# Altium schematic sheet PSU_VCC5V_Buck.SchDoc
size A3; SheetNumber: 3; SheetTotal: 32
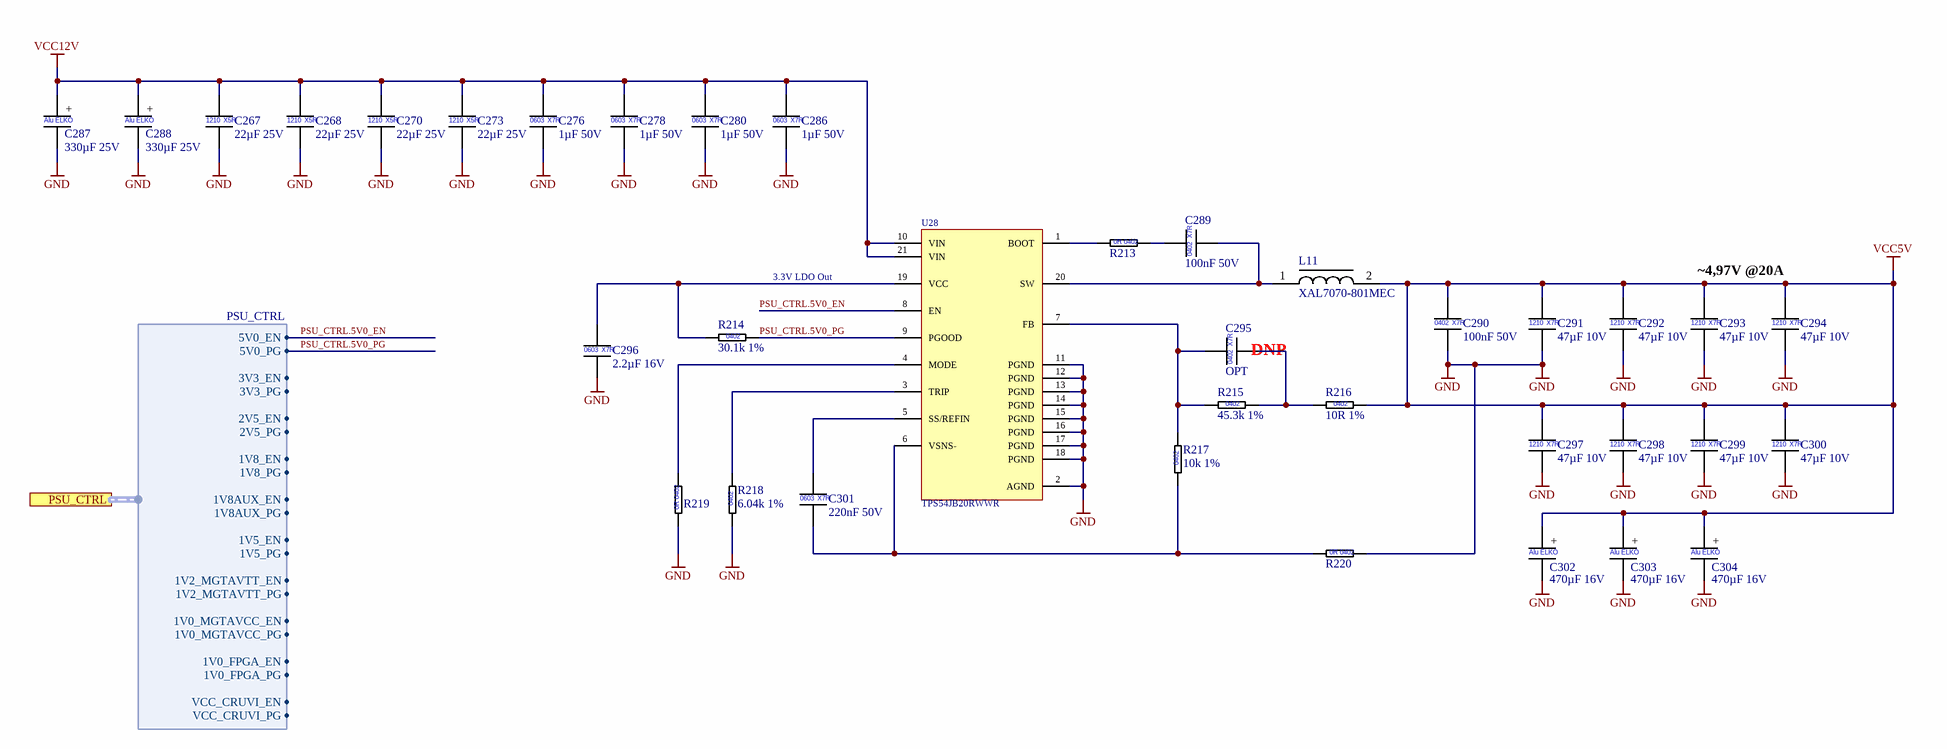
[diagram p0: PSU_VCC5V_Buck.SchDoc]

## Parts
C267  22µF 25V  [CAP_1210]
C268  22µF 25V  [CAP_1210]
C270  22µF 25V  [CAP_1210]
C273  22µF 25V  [CAP_1210]
C276  1µF 50V  [CAP_0603]
C278  1µF 50V  [CAP_0603]
C280  1µF 50V  [CAP_0603]
C286  1µF 50V  [CAP_0603]
C287  330µF 25V  [WCAP-PTG5_D10H12.5]
C288  330µF 25V  [WCAP-PTG5_D10H12.5]
C289  100nF 50V  [CAP_0402]
C290  100nF 50V  [CAP_0402]
C291  47µF 10V  [CAP_1210]
C292  47µF 10V  [CAP_1210]
C293  47µF 10V  [CAP_1210]
C294  47µF 10V  [CAP_1210]
C295  OPT  [CAP_0402]  (no BOM)
C296  2.2µF 16V  [CAP_0603]
C297  47µF 10V  [CAP_1210]
C298  47µF 10V  [CAP_1210]
C299  47µF 10V  [CAP_1210]
C300  47µF 10V  [CAP_1210]
C301  220nF 50V  [CAP_0603]
C302  470µF 16V  [WCAP-PTG5_D8H13]
C303  470µF 16V  [WCAP-PTG5_D8H13]
C304  470µF 16V  [WCAP-PTG5_D8H13]
L11  XAL7070-801MEC  [COILCRAFT_XAL7070]
R213  0R Jumper  [RES_0402]  (value not drawn)
R214  30.1k 1%  [RES_0402]
R215  45.3k 1%  [RES_0402]
R216  10R 1%  [RES_0402]
R217  10k 1%  [RES_0402]
R218  6.04k 1%  [RES_0402]
R219  0R Jumper  [RES_0402]  (value not drawn)
R220  0R Jumper  [RES_0402]  (value not drawn)
U28  TPS54JB20RWWR  [VQFN-HR21_RWW0021A]

## Ports
PSU_CTRL (harness PSU_CTRL, see Power-Tree[2B], PSU_MGTAVCC_Buck[1B], PSU_MGTAVTT_Buck[1B], PSU_VCC1V0_FPGA_Buck[1B], PSU_VCC1V5_Buck[1B], PSU_VCC1V8_Buck[1B], PSU_VCC1V8AUX_Buck[1B], PSU_VCC2V5_Buck[1B], PSU_VCC3V3_Buck[1B], PSU_VCC_CRUVI_ADJ_Buck[1B])

## Harnesses
PSU_CTRL: 5V0_EN, 5V0_PG, 3V3_EN, 3V3_PG, 2V5_EN, 2V5_PG, 1V8_EN, 1V8_PG, 1V8AUX_EN, 1V8AUX_PG, 1V5_EN, 1V5_PG, 1V2_MGTAVTT_EN, 1V2_MGTAVTT_PG, 1V0_MGTAVCC_EN, 1V0_MGTAVCC_PG, 1V0_FPGA_EN, 1V0_FPGA_PG, VCC_CRUVI_EN, VCC_CRUVI_PG

## Nets
GND: C267.2 C268.2 C270.2 C273.2 C276.2 C278.2 C280.2 C286.2 C287.2 C288.2 C290.2 C291.2 C292.2 C293.2 C294.2 C296.2 C297.2 C298.2 C299.2 C300.2 C302.2 C303.2 C304.2 R218.1 R219.1 R220.2 U28.2(AGND) U28.11(PGND) U28.12(PGND) U28.13(PGND) U28.14(PGND) U28.15(PGND) U28.16(PGND) U28.17(PGND) U28.18(PGND)
VCC5V: C290.1 C291.1 C292.1 C293.1 C294.1 C297.1 C298.1 C299.1 C300.1 C302.1 C303.1 C304.1 L11.2 R216.2
VCC12V: C267.1 C268.1 C270.1 C273.1 C276.1 C278.1 C280.1 C286.1 C287.1 C288.1 U28.10(VIN) U28.21(VIN)
PSU_CTRL.5V0_EN: U28.8(EN) ; port PSU_CTRL.5V0_EN
PSU_CTRL.5V0_PG: R214.2 U28.9(PGOOD) ; port PSU_CTRL.5V0_PG
NetC289_1: C289.1 R213.2
NetC289_2: C289.2 L11.1 U28.20(SW)
NetC295_1: C295.1 R215.1 R217.2 U28.7(FB)
NetC295_2: C295.2 R215.2 R216.1
NetC296_1: C296.1 R214.1 U28.19(VCC)
NetC301_1: C301.1 U28.5(SS/REFIN)
NetC301_2: C301.2 R217.1 R220.1 U28.6(VSNS-)
NetR213_1: R213.1 U28.1(BOOT)
NetR218_2: R218.2 U28.3(TRIP)
NetR219_2: R219.2 U28.4(MODE)

## Notes on the sheet
- 3.3V LDO Out
- (near C294) ~4,97V @20A
- (near C295) DNP
- Company:
- Contact:
- Customer:
- mail@pcb-arts.com
- PCB Arts GmbH
- Title:
- Project:
- The  information  contained  in  these  documents  is  confidential,  privileged  and  only  for  the information of the intended recipient and may not be used, published or redistributed Without the prior written consent from PCB Arts GmbH.
- Engineer:
- Document Number:
- Revision:
- Variant:
- Date:
- Time:
- Sheet:
- Status:
- /
- (in symbol CAP_0402_100nF_50V) X7R; 0402
- (in symbol CAP_0402_OPT) X7R; 0402
- (in symbol CAP_0603_1µF_50V_X7R_10%) 0603; X7R
- (in symbol CAP_0603_2.2µF_16V_X7R_10%) 0603; X7R
- (in symbol CAP_0603_220nF_50V_X7R_10%) 0603; X7R
- (in symbol CAP_1210_22µF_25V) 1210; X5R
- (in symbol CAP_1210_47µF_10V_X7R_10%) 1210; X7R
- (in symbol CAP_D8L9_470µF_16V) +; Alu ELKO
- (in symbol CAP_D10L12.5_330µF_25V) +; Alu ELKO
- (in symbol RES_0402_0R Jumper) 0R 0402
- (in symbol RES_0402_6.04k_1%) 0402
- (in symbol RES_0402_10k_1%) 0402
- (in symbol RES_0402_10R_1%) 0402
- (in symbol RES_0402_30.1k_1%) 0402
- (in symbol RES_0402_45.3k_1%) 0402

## Library data of the parts
C267 C268 C270 C273 = CAP_1210_22µF_25V: Multilayer Ceramic Capacitors MLCC - SMD/SMT 1210 25VDC; Manufacturer 1: KEMET; Manufacturer 1 Prt. Nr.: C1210C226K3PACTU; Manufacturer 2 Prt. Nr.: TMK212BBJ226MG-TT; Manufacturer 2: Taiyo Yuden
C276 C278 C280 C286 = CAP_0603_1µF_50V_X7R_10%: Multilayer Ceramic Capacitors MLCC - SMD/SMT 50V 1uF X7R 0603 10%; Manufacturer 1: KYOCERA AVX; Manufacturer 1 Prt. Nr.: 06035C105KAT2A; Manufacturer 2 Prt. Nr.: MSASU168AB7105KTNA01; Manufacturer 2: TAIYO YUDEN
C287 C288 = CAP_D10L12.5_330µF_25V: Organische Polymer-Aluminiumkondensatoren 330uF 25 Volts 20% AEC-Q200; Manufacturer 1: Würth Elektronik; Manufacturer 1 Prt. Nr.: 870025575009
C289 C290 = CAP_0402_100nF_50V: Multilayer Ceramic Capacitors MLCC - SMD/SMT 0402 50VDC; Manufacturer 1: Murata Electronics; Manufacturer 1 Prt. Nr.: GCM155L8EH104KE07D; Manufacturer 2 Prt. Nr.: UMK105B7104KV-FR; Manufacturer 2: TDK
C291-C294 C297-C300 = CAP_1210_47µF_10V_X7R_10%: Multilayer Ceramic Capacitors MLCC - SMD/SMT 47 uF 10 VDC 10% 1210 X7R; Manufacturer 1: Murata Electronics; Manufacturer 1 Prt. Nr.: GRM32ER71A476KE15L; Manufacturer 2 Prt. Nr.: C1210C106K8RACTU; Manufacturer 2: KEMET
C295 = CAP_0402_OPT: Multilayer Ceramic Capacitors MLCC - SMD/SMT 0402 Optional Placeholder
C296 = CAP_0603_2.2µF_16V_X7R_10%: Multilayer Ceramic Capacitors MLCC - SMD/SMT 2.2 uF 16 VDC 10% 0603 X7R; Manufacturer 1: Murata Electronics; Manufacturer 1 Prt. Nr.: GRM188Z71C225KE43D; Manufacturer 2 Prt. Nr.: EMK107BB7225KA-T; Manufacturer 2: TAIYO YUDEN
C301 = CAP_0603_220nF_50V_X7R_10%: Multilayer Ceramic Capacitors MLCC - SMD/SMT 0.22 uF 50 VDC 10% 0603 X7R; Manufacturer 1: Murata Electronics; Manufacturer 1 Prt. Nr.: GRJ188R71H224KE11D; Manufacturer 2 Prt. Nr.: CGA3E3X7R1H224K080AE; Manufacturer 2: TDK
C302-C304 = CAP_D8L9_470µF_16V: Organische Polymer-Aluminiumkondensatoren 470uF 16 Volts 20%; Manufacturer 1: Würth Elektronik; Manufacturer 1 Prt. Nr.: 870025374007
L11 = XAL7070-801MEC_Power Inductors SMD 800nH Shld 20% 25.8A 2.29mOhms AECQ200: Power Inductors - SMD 800nH Shld 20% 25.8A 2.29mOhms AECQ200; Manufacturer 1: Coilcraft; Manufacturer 1 Prt. Nr.: XAL7070-801MEC
R213 R219 R220 = RES_0402_0R Jumper: Thick Film Resistors - SMD 0Ohm; Manufacturer 1: Vishay / Dale; Manufacturer 1 Prt. Nr.: CRCW04020000Z0EDC; Manufacturer 2 Prt. Nr.: RC0402JR-070RL; Manufacturer 2: Yageo
R214 = RES_0402_30.1k_1%: Thick Film Resistors - SMD 30.1kOhm 1%; Manufacturer 1: Vishay / Dale; Manufacturer 1 Prt. Nr.: CRCW040230K1FKEDC; Manufacturer 2 Prt. Nr.: RC0402FR-1330K1L; Manufacturer 2: Yageo
R215 = RES_0402_45.3k_1%: Thick Film Resistors - SMD 45.3kOhm 1%; Manufacturer 1: Vishay / Dale; Manufacturer 1 Prt. Nr.: CRCW040245K3FKEDC; Manufacturer 2 Prt. Nr.: RC0402FR-0745K3L; Manufacturer 2: Yageo
R216 = RES_0402_10R_1%: Thick Film Resistors - SMD 10Ohm 1%; Manufacturer 1: Vishay / Dale; Manufacturer 1 Prt. Nr.: CRCW040210R0FKEE; Manufacturer 2 Prt. Nr.: RC0402FR-7W10RL; Manufacturer 2: Yageo
R217 = RES_0402_10k_1%: Thick Film Resistors - SMD 10kOhm 1%; Manufacturer 1: Vishay / Dale; Manufacturer 1 Prt. Nr.: CRCW040210K0FKEDC; Manufacturer 2 Prt. Nr.: RC0402FR-7W10KL; Manufacturer 2: Yageo
R218 = RES_0402_6.04k_1%: Thick Film Resistors - SMD 6.04kOhm 1%; Manufacturer 1: Vishay / Dale; Manufacturer 1 Prt. Nr.: CRCW04026K04FKEDC; Manufacturer 2 Prt. Nr.: RC0402FR-7W6K04L; Manufacturer 2: Yageo
U28 = TPS54JB20RWWR_Switching Voltage Regulators 2.7-V to 16-V input 20-A synchronous Buck: Switching Voltage Regulators 2.7-V to 16-V input 20-A synchronous Buck; Manufacturer 1: Texas Instruments; Manufacturer 1 Prt. Nr.: TPS54JB20RWWR